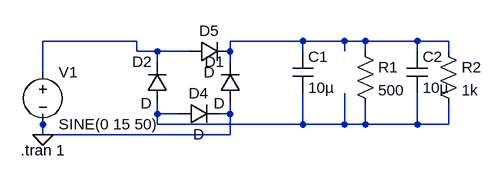
[diagram p0: schematic Voltage_regulator_unfinished.asc]
Voltage_regulator_unfinished.asc, the LTspice schematic file:
Version 4
SHEET 1 880 680
WIRE 48 64 -96 64
WIRE 304 64 192 64
WIRE 368 64 304 64
WIRE 400 64 368 64
WIRE 480 64 400 64
WIRE 528 64 480 64
WIRE 48 80 48 64
WIRE 80 80 48 80
WIRE 128 80 80 80
WIRE 192 80 192 64
WIRE 304 80 304 64
WIRE 368 80 368 64
WIRE 400 80 400 64
WIRE 480 80 480 64
WIRE 528 80 528 64
WIRE 80 96 80 80
WIRE 192 96 192 80
WIRE -96 112 -96 64
WIRE 80 176 80 160
WIRE 112 176 80 176
WIRE 192 176 192 160
WIRE 192 176 176 176
WIRE -96 192 -96 176
WIRE 80 192 80 176
WIRE 304 192 304 144
WIRE 304 192 80 192
WIRE 368 192 368 144
WIRE 368 192 304 192
WIRE 400 192 400 160
WIRE 400 192 368 192
WIRE 480 192 480 144
WIRE 480 192 400 192
WIRE 528 192 528 160
WIRE 528 192 480 192
WIRE -96 208 -96 192
WIRE 192 208 192 176
WIRE 192 208 -96 208
FLAG -96 208 0
SYMBOL voltage -96 96 R0
WINDOW 123 0 0 Left 0
WINDOW 39 0 0 Left 0
SYMATTR InstName V1
SYMATTR Value SINE(0 15 50)
SYMBOL diode 208 160 R180
WINDOW 0 24 64 Left 2
WINDOW 3 24 0 Left 2
SYMATTR InstName D1
SYMBOL diode 112 192 R270
WINDOW 0 32 32 VTop 2
WINDOW 3 0 32 VBottom 2
SYMATTR InstName D4
SYMBOL diode 128 96 R270
WINDOW 0 32 32 VTop 2
WINDOW 3 0 32 VBottom 2
SYMATTR InstName D5
SYMBOL diode 96 160 R180
WINDOW 0 24 64 Left 2
WINDOW 3 24 0 Left 2
SYMATTR InstName D2
SYMBOL res 384 64 R0
SYMATTR InstName R1
SYMATTR Value 500
SYMBOL cap 288 80 R0
SYMATTR InstName C1
SYMATTR Value 10µ
SYMBOL cap 464 80 R0
SYMATTR InstName C2
SYMATTR Value 10µ
SYMBOL res 512 64 R0
SYMATTR InstName R2
SYMATTR Value 1k
TEXT -130 232 Left 2 !.tran 1

The netlist it stands for:
* Voltage_regulator_unfinished.asc
V1 N001 0 SINE(0 15 50)
D1 0 N002 D
D4 N003 0 D
D5 N001 N002 D
D2 N003 N001 D
R1 N002 N003 500
C1 N002 N003 10µ
C2 N002 N003 10µ
R2 N002 N003 1k
.model D D
.lib standard.dio
.tran 1
.backanno
.end